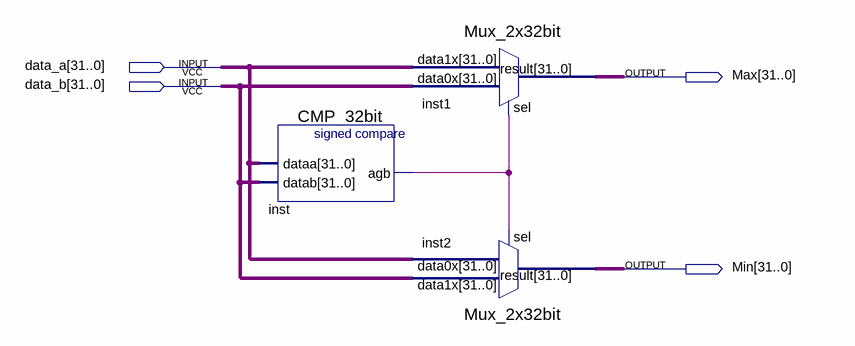
[diagram p0: schematic sheet]
// Quartus schematic max_minnot.bdf as structural Verilog: 3 symbols, 4 pins
module max_minnot (
  input  [31:0] data_a,
  input  [31:0] data_b,
  output [31:0] Max,
  output [31:0] Min
);

  wire inst_agb;

  CMP_32bit inst (.dataa(data_a), .datab(data_b), .agb(inst_agb));
  Mux_2x32bit inst1 (.data1x(data_a), .data0x(data_b), .sel(inst_agb), .result(Max));
  Mux_2x32bit inst2 (.data1x(data_b), .data0x(data_a), .sel(inst_agb), .result(Min));
endmodule
